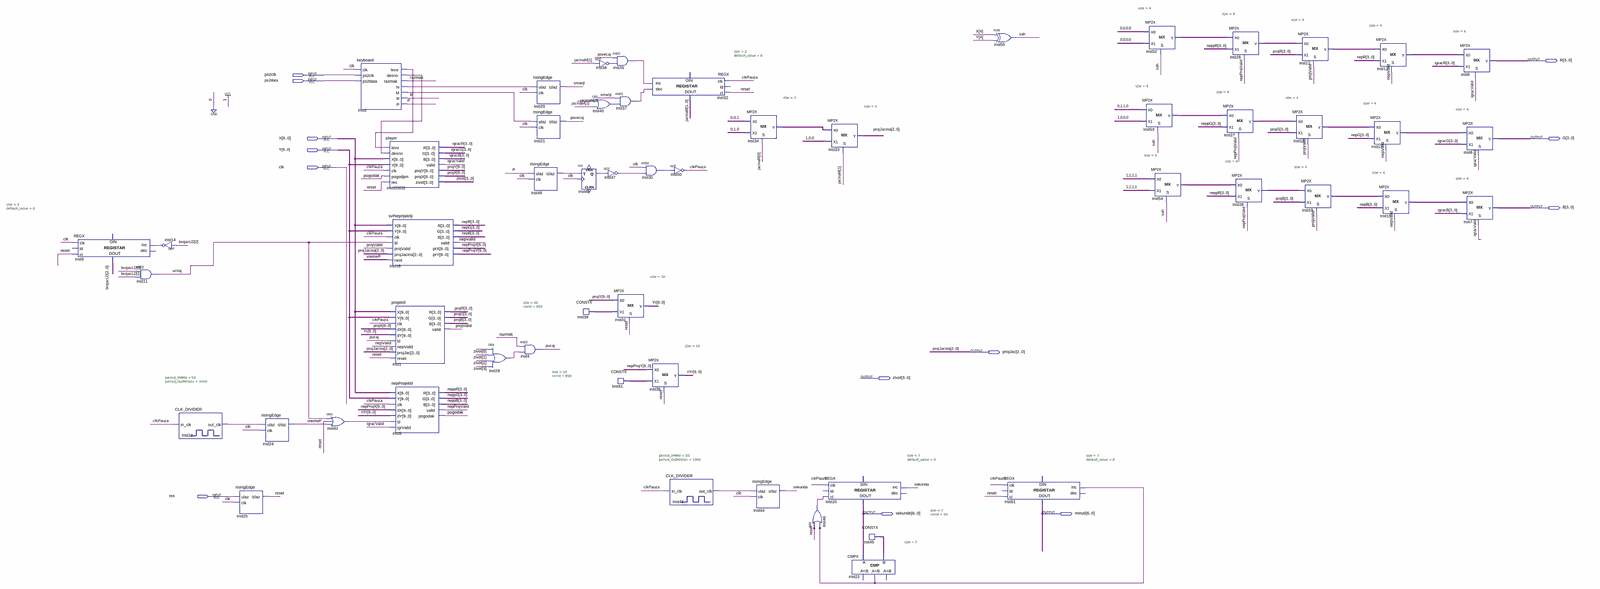
[diagram p0: schematic sheet, whole]
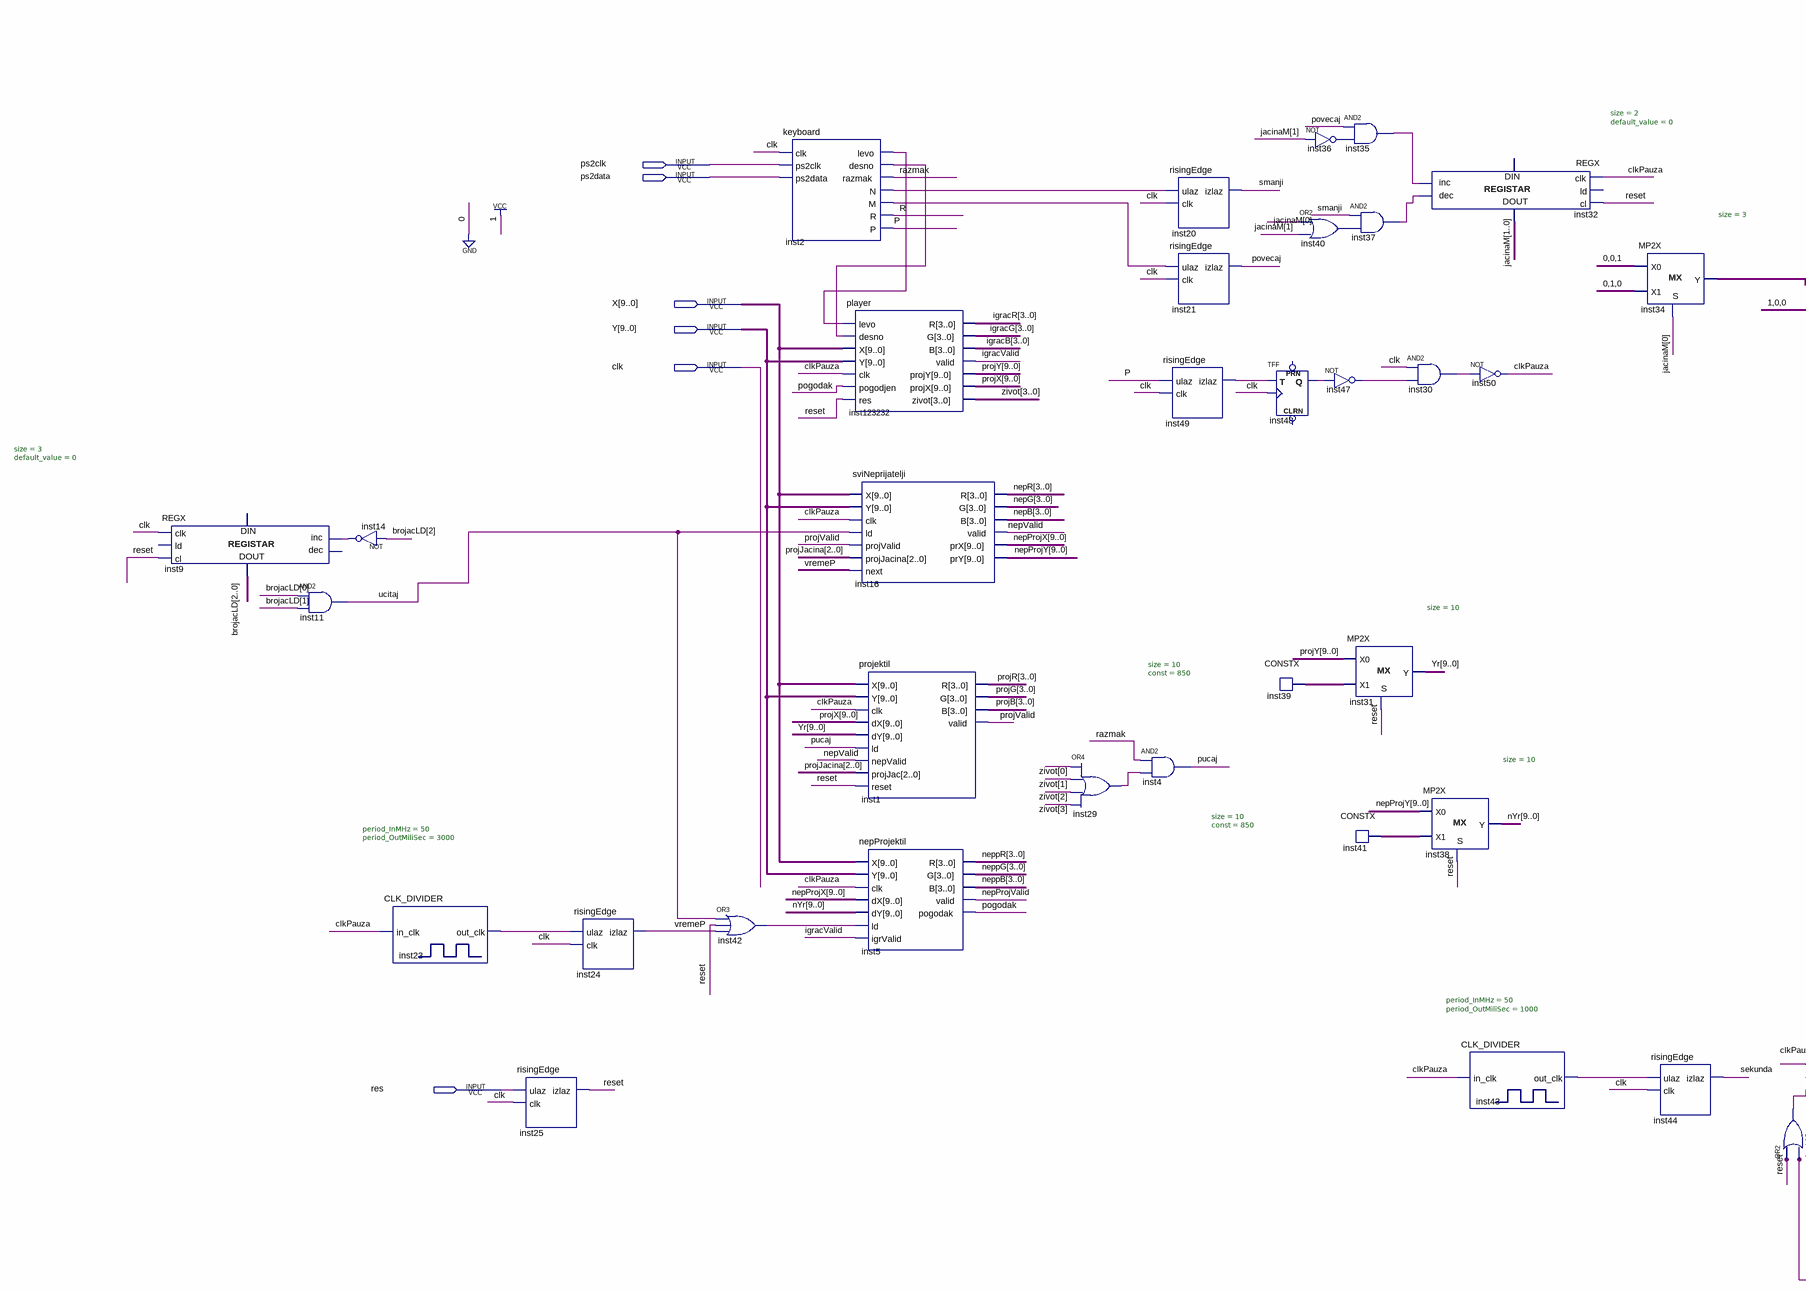
[diagram p1: schematic sheet, left part]
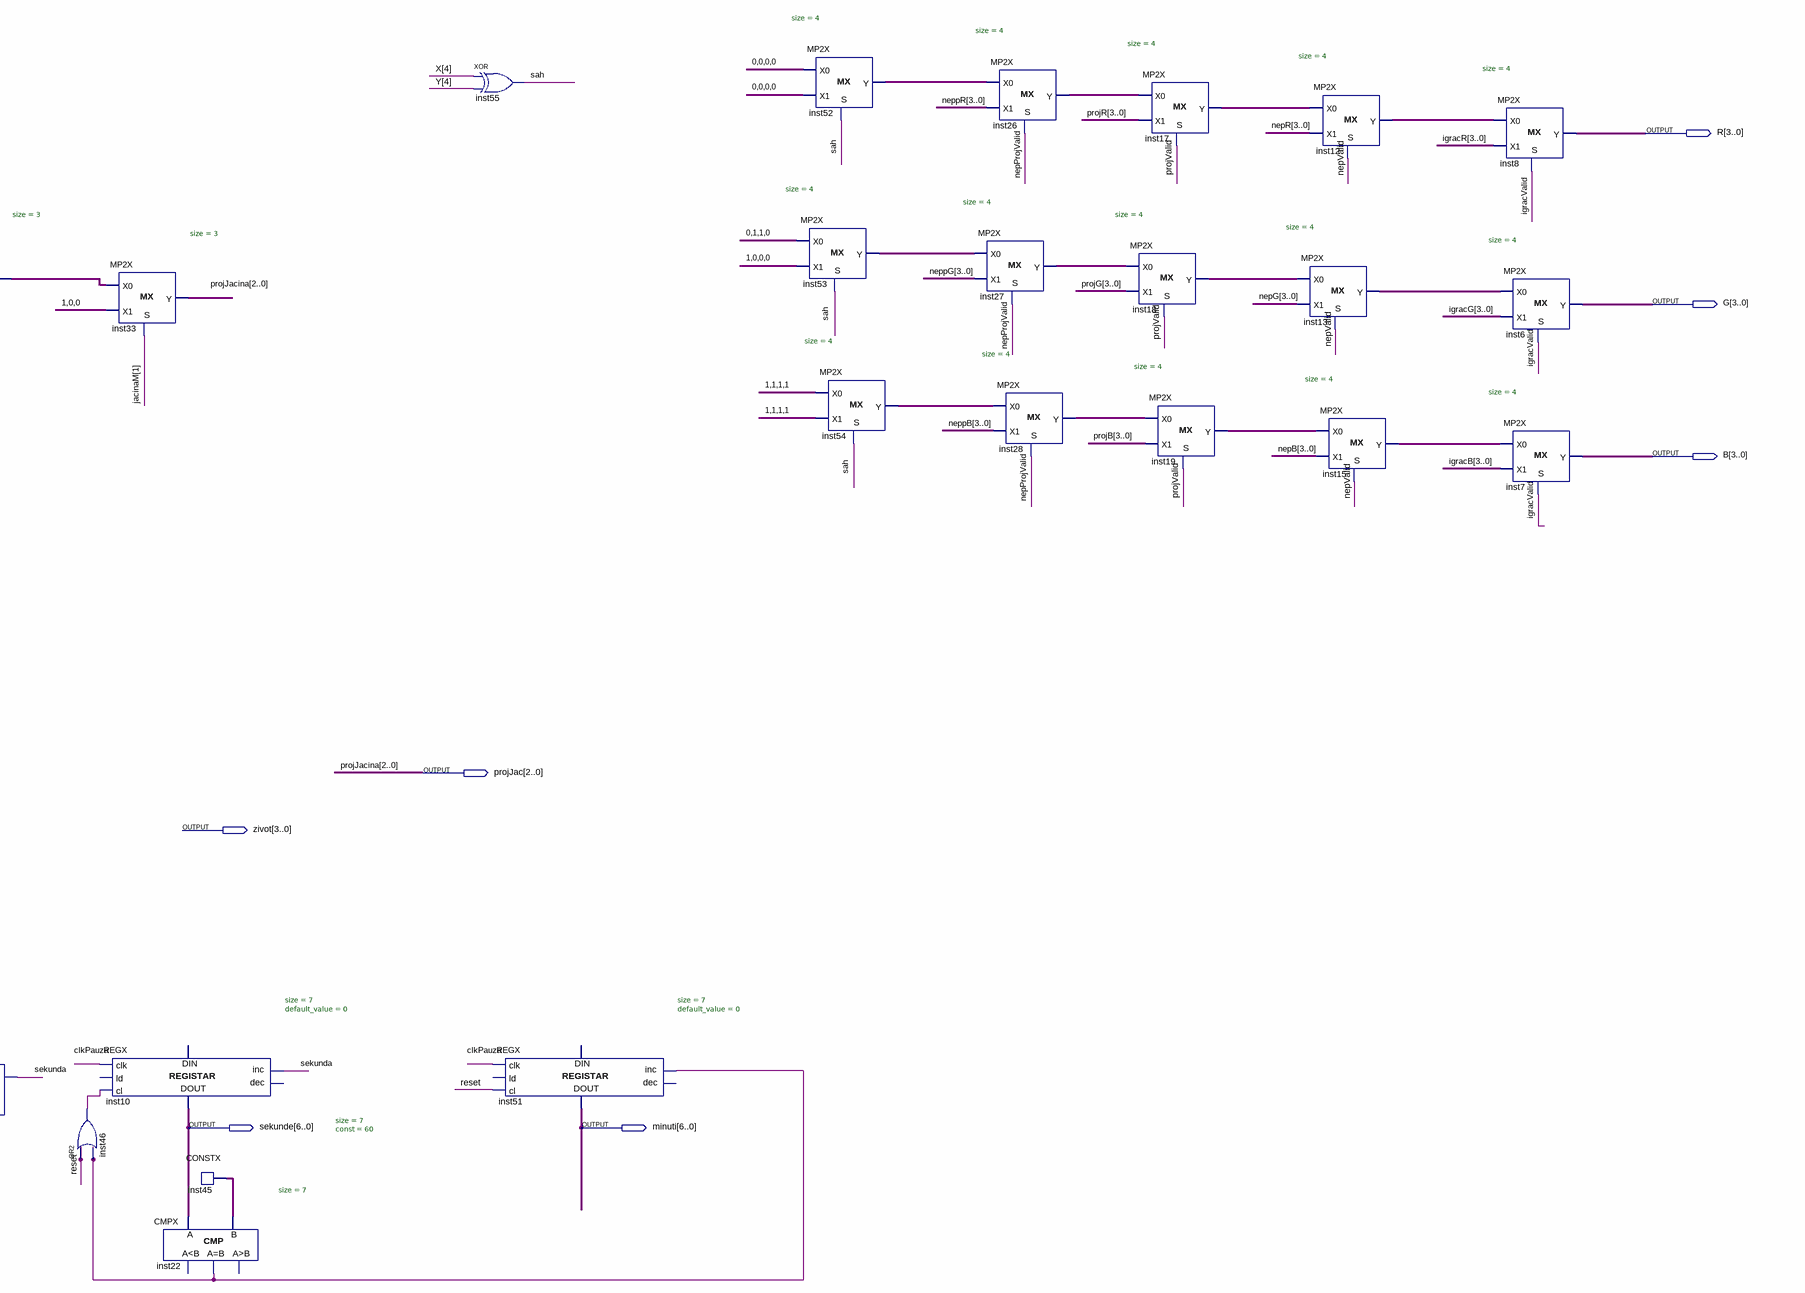
[diagram p2: schematic sheet, right part]
// Quartus schematic igrica.bdf as structural Verilog: 55 symbols, 13 pins
module igrica (
  input  ps2clk,
  input  ps2data,
  input  [9:0] X,
  input  [9:0] Y,
  input  clk,
  input  res,
  output [3:0] R,
  output [3:0] G,
  output [3:0] B,
  output [2:0] projJac,
  output [3:0] zivot,
  output [6:0] sekunde,
  output [6:0] minuti
);

  wire clkPauza, igracValid, inst2_desno, inst2_levo, inst2_m, inst2_n, inst14_out, inst22_eq,
       inst23_out_clk, inst29_out, inst30_out, inst35_out, inst36_out, inst37_out, inst40_out, inst42_out,
       inst43_out_clk, inst46_out, inst47_out, inst48_q, inst49_izlaz, nepProjValid, nepValid, P, pogodak,
       povecaj, projValid, pucaj, R_1bit, razmak, reset, sah, sekunda, smanji, ucitaj, vremeP;
  wire [1:0] jacinaM;
  wire [2:0] brojacLD, inst34_y;
  wire [3:0] igracB, igracG, igracR, inst12_y, inst13_y, inst15_y, inst17_y, inst18_y, inst19_y, inst26_y,
       inst27_y, inst28_y, inst52_y, inst53_y, inst54_y, nepB, nepG, neppB, neppG, neppR, nepR, projB, projG,
       projR;
  wire [6:0] inst45_data;
  wire [9:0] inst39_data, inst41_data, nepProjX, nepProjY, nYr, projX, projY, Yr;

  REGX #(.size(3), .default_value(0)) inst9 (
    .clk(clk), .cl(reset), .inc(inst14_out), .data_out(brojacLD));  // open: ld, dec, data_in
  and inst11 (ucitaj, brojacLD[0], brojacLD[1]);
  not inst14 (inst14_out, brojacLD[2]);
  CLK_DIVIDER #(.period_InMHz(50), .period_OutMiliSec(3000)) inst23 (.in_clk(clkPauza), .out_clk(inst23_out_clk));
  risingEdge inst25 (.ulaz(res), .clk(clk), .izlaz(reset));
  risingEdge inst24 (.ulaz(inst23_out_clk), .clk(clk), .izlaz(vremeP));
  or inst42 (inst42_out, ucitaj, reset, vremeP);
  keyboard inst2 (
    .clk(clk), .ps2clk(ps2clk), .ps2data(ps2data), .levo(inst2_levo), .desno(inst2_desno), .razmak(razmak),
    .N(inst2_n), .M(inst2_m), .R(R_1bit), .P(P));
  player inst123232 (
    .levo(inst2_levo), .desno(inst2_desno), .X(X), .Y(Y), .clk(clkPauza), .pogodjen(pogodak), .res(reset),
    .R(igracR), .G(igracG), .B(igracB), .valid(igracValid), .projY(projY), .projX(projX), .zivot(zivot));
  sviNeprijatelji inst16 (
    .X(X), .Y(Y), .clk(clkPauza), .ld(ucitaj), .projValid(projValid), .projJacina(projJac), .next(vremeP),
    .R(nepR), .G(nepG), .B(nepB), .valid(nepValid), .prX(nepProjX), .prY(nepProjY));
  projektil inst1 (
    .X(X), .Y(Y), .clk(clkPauza), .dX(projX), .dY(Yr), .ld(pucaj), .nepValid(nepValid), .projJac(projJac),
    .reset(reset), .R(projR), .G(projG), .B(projB), .valid(projValid));
  nepProjektil inst5 (
    .X(X), .Y(Y), .clk(clkPauza), .dX(nepProjX), .dY(nYr), .ld(inst42_out), .igrValid(igracValid), .R(neppR),
    .G(neppG), .B(neppB), .valid(nepProjValid), .pogodak(pogodak));
  or inst29 (inst29_out, zivot[0], zivot[1], zivot[2], zivot[3]);
  and inst4 (pucaj, razmak, inst29_out);
  risingEdge inst20 (.ulaz(inst2_n), .clk(clk), .izlaz(smanji));
  risingEdge inst21 (.ulaz(inst2_m), .clk(clk), .izlaz(povecaj));
  risingEdge inst49 (.ulaz(P), .clk(clk), .izlaz(inst49_izlaz));
  TFF inst48 (.T(inst49_izlaz), .CLK(clk), .Q(inst48_q));  // open: PRN, CLRN
  CONSTX #(.size(10), .\const (850)) inst39 (.data(inst39_data));
  and inst35 (inst35_out, povecaj, inst36_out);
  not inst36 (inst36_out, jacinaM[1]);
  or inst40 (inst40_out, jacinaM[0], jacinaM[1]);
  not inst47 (inst47_out, inst48_q);
  MP2X #(.size(10)) inst31 (.S(reset), .X0(projY), .X1(inst39_data), .Y(Yr));
  CONSTX #(.size(10), .\const (850)) inst41 (.data(inst41_data));
  and inst37 (inst37_out, smanji, inst40_out);
  REGX #(.size(2), .default_value(0)) inst32 (
    .clk(clkPauza), .cl(reset), .inc(inst35_out), .dec(inst37_out), .data_out(jacinaM));  // open: ld, data_in
  and inst30 (inst30_out, clk, inst47_out);
  MP2X #(.size(10)) inst38 (.S(reset), .X0(nepProjY), .X1(inst41_data), .Y(nYr));
  not inst50 (clkPauza, inst30_out);
  CLK_DIVIDER #(.period_InMHz(50), .period_OutMiliSec(1000)) inst43 (.in_clk(clkPauza), .out_clk(inst43_out_clk));
  MP2X #(.size(3)) inst34 (.S(jacinaM[0]), .X0(3'b001), .X1(3'b010), .Y(inst34_y));
  risingEdge inst44 (.ulaz(inst43_out_clk), .clk(clk), .izlaz(sekunda));
  or inst46 (inst46_out, reset, inst22_eq);
  MP2X #(.size(3)) inst33 (.S(jacinaM[1]), .X0(inst34_y), .X1(3'b100), .Y(projJac));
  REGX #(.size(7), .default_value(0)) inst10 (
    .clk(clkPauza), .cl(inst46_out), .inc(sekunda), .data_out(sekunde));  // open: ld, dec, data_in
  CONSTX #(.size(7), .\const (60)) inst45 (.data(inst45_data));
  CMPX #(.size(7)) inst22 (.A(sekunde), .B(inst45_data), .eq(inst22_eq));  // open: ls, gr
  xor inst55 (sah, X[4], Y[4]);
  REGX #(.size(7), .default_value(0)) inst51 (
    .clk(clkPauza), .cl(reset), .inc(inst22_eq), .data_out(minuti));  // open: ld, dec, data_in
  MP2X #(.size(4)) inst52 (.S(sah), .X0(4'b0000), .X1(4'b0000), .Y(inst52_y));
  MP2X #(.size(4)) inst53 (.S(sah), .X0(4'b0110), .X1(4'b1000), .Y(inst53_y));
  MP2X #(.size(4)) inst54 (.S(sah), .X0(4'b1111), .X1(4'b1111), .Y(inst54_y));
  MP2X #(.size(4)) inst26 (.S(nepProjValid), .X0(inst52_y), .X1(neppR), .Y(inst26_y));
  MP2X #(.size(4)) inst27 (.S(nepProjValid), .X0(inst53_y), .X1(neppG), .Y(inst27_y));
  MP2X #(.size(4)) inst28 (.S(nepProjValid), .X0(inst54_y), .X1(neppB), .Y(inst28_y));
  MP2X #(.size(4)) inst17 (.S(projValid), .X0(inst26_y), .X1(projR), .Y(inst17_y));
  MP2X #(.size(4)) inst18 (.S(projValid), .X0(inst27_y), .X1(projG), .Y(inst18_y));
  MP2X #(.size(4)) inst19 (.S(projValid), .X0(inst28_y), .X1(projB), .Y(inst19_y));
  MP2X #(.size(4)) inst12 (.S(nepValid), .X0(inst17_y), .X1(nepR), .Y(inst12_y));
  MP2X #(.size(4)) inst13 (.S(nepValid), .X0(inst18_y), .X1(nepG), .Y(inst13_y));
  MP2X #(.size(4)) inst15 (.S(nepValid), .X0(inst19_y), .X1(nepB), .Y(inst15_y));
  MP2X #(.size(4)) inst8 (.S(igracValid), .X0(inst12_y), .X1(igracR), .Y(R));
  MP2X #(.size(4)) inst6 (.S(igracValid), .X0(inst13_y), .X1(igracG), .Y(G));
  MP2X #(.size(4)) inst7 (.S(igracValid), .X0(inst15_y), .X1(igracB), .Y(B));

  // Other names for the same wires on the sheet: projJacina[2:0] = projJac
endmodule
